# Altium schematic sheet USB-HUB-MUX.SchDoc
size A3; SheetNumber: 30; SheetTotal: 32
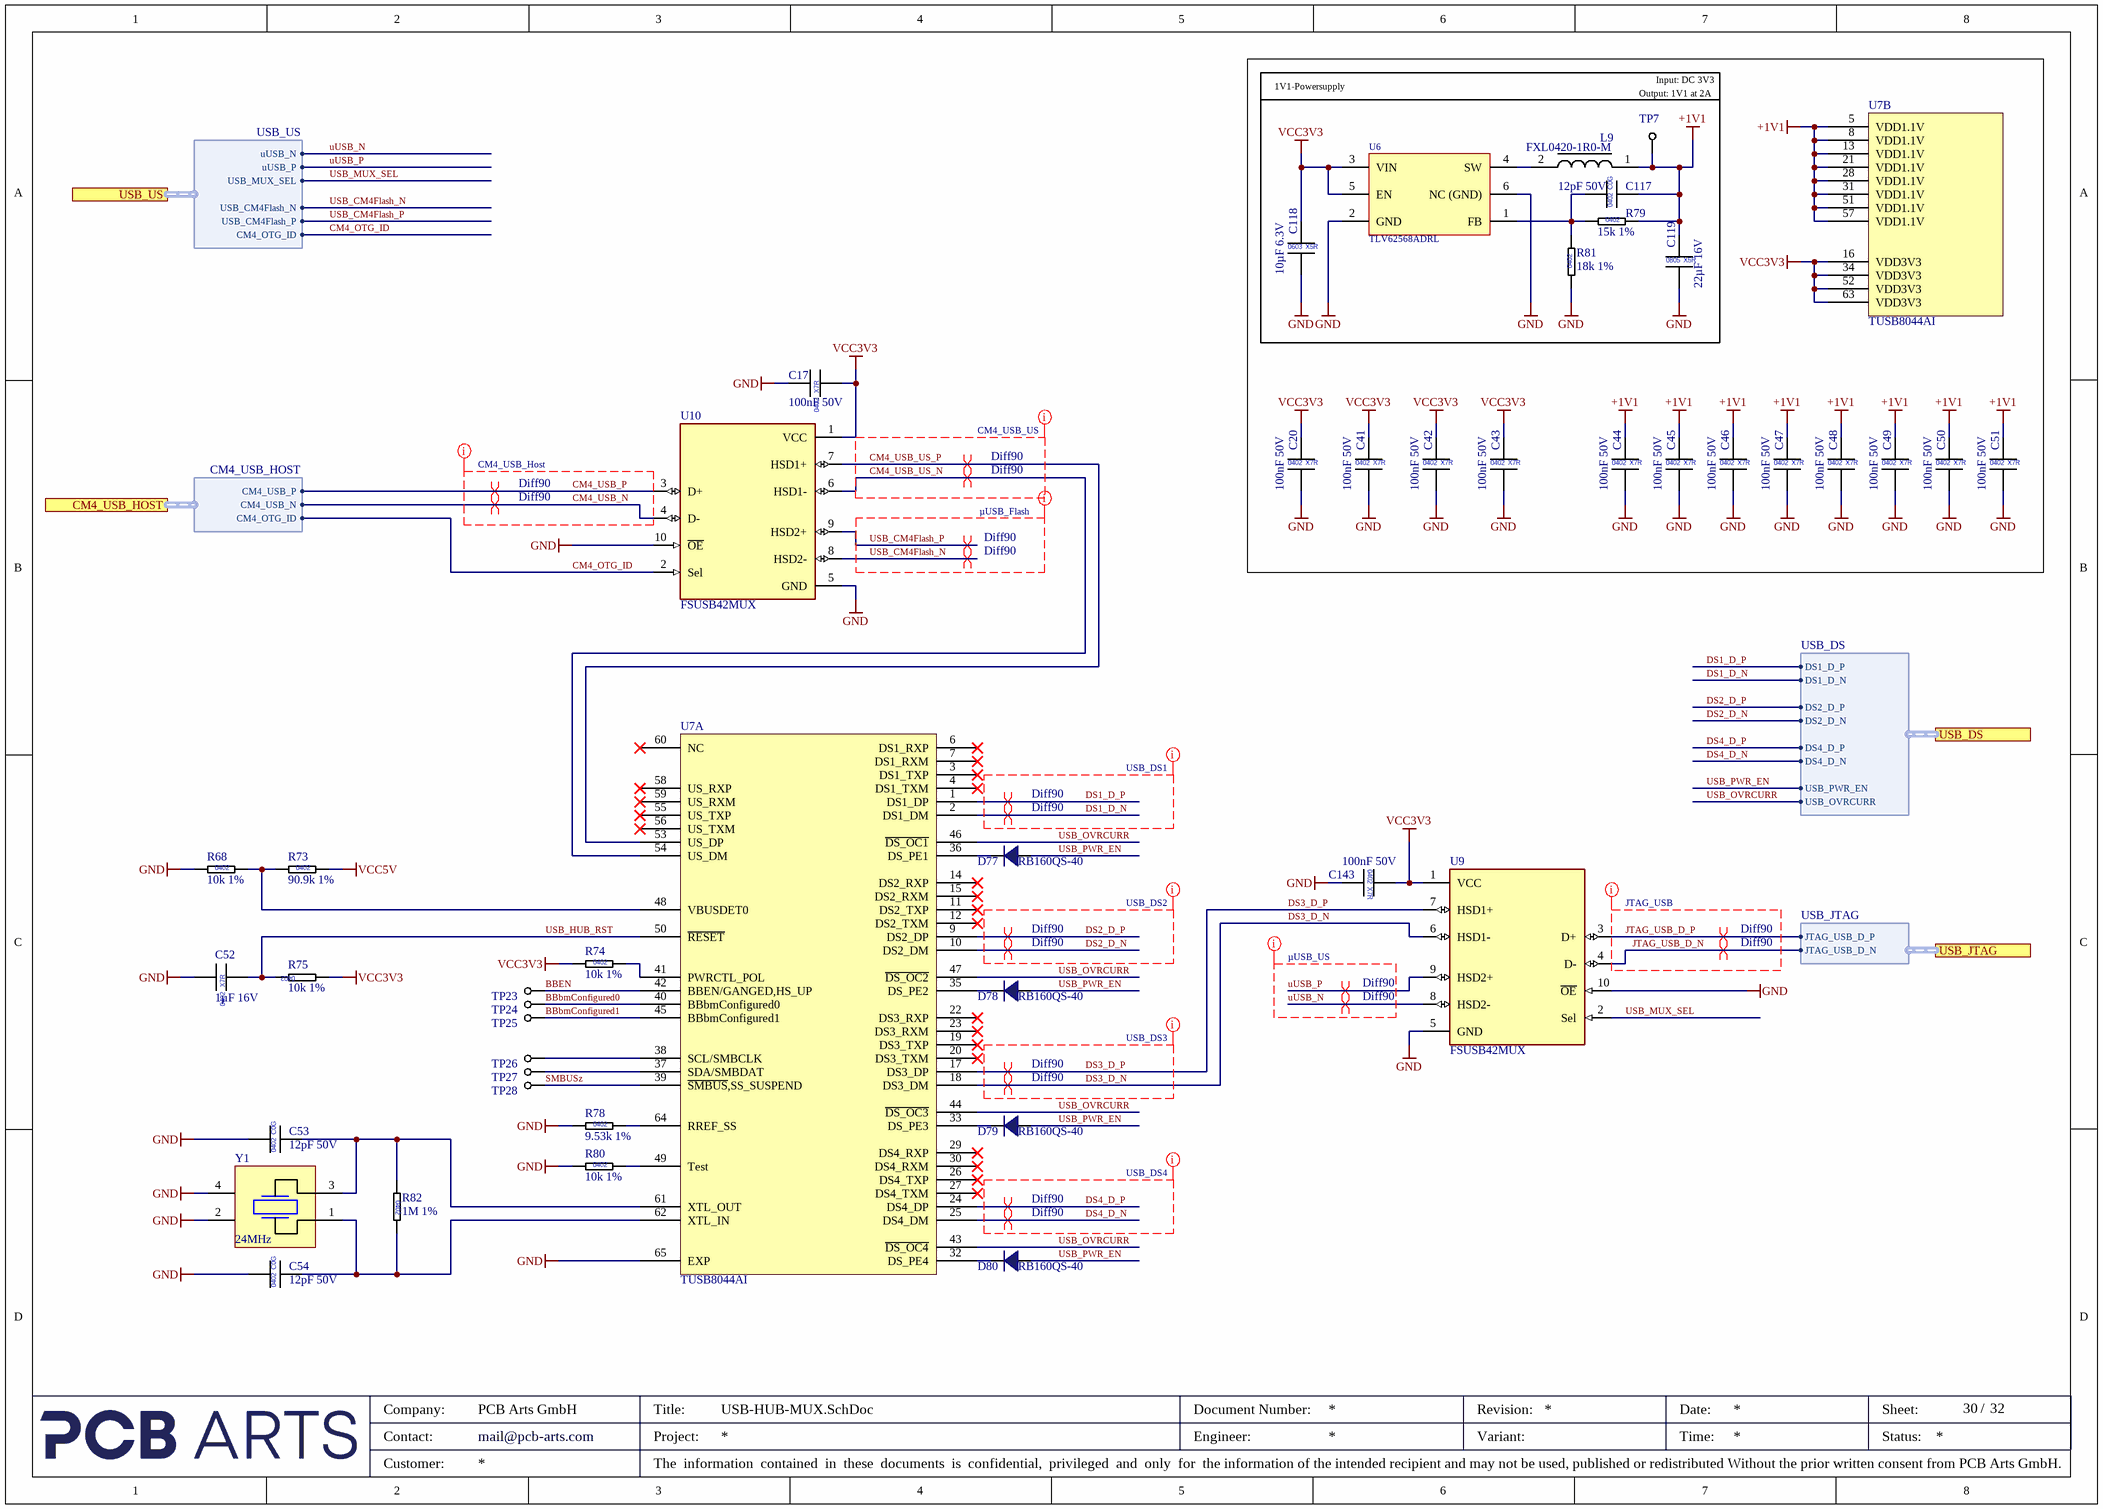
[diagram p0: USB-HUB-MUX.SchDoc]

## Parts
C17  100nF 50V  [CAP_0402_L]
C20  100nF 50V  [CAP_0402_L]
C41  100nF 50V  [CAP_0402_L]
C42  100nF 50V  [CAP_0402_L]
C43  100nF 50V  [CAP_0402_L]
C44  100nF 50V  [CAP_0402_L]
C45  100nF 50V  [CAP_0402_L]
C46  100nF 50V  [CAP_0402_L]
C47  100nF 50V  [CAP_0402_L]
C48  100nF 50V  [CAP_0402_L]
C49  100nF 50V  [CAP_0402_L]
C50  100nF 50V  [CAP_0402_L]
C51  100nF 50V  [CAP_0402_L]
C52  1µF 16V  [CAP_0402_L]
C53  12pF 50V  [CAP_0402_L]
C54  12pF 50V  [CAP_0402_L]
C117  12pF 50V  [CAP_0402_L]
C118  10µF 6.3V  [CAP_0603_L]
C119  22µF 16V  [CAP_0805]
C143  100nF 50V  [CAP_0402_L]
D77  RB160QS-40  [SOD-882]
D78  RB160QS-40  [SOD-882]
D79  RB160QS-40  [SOD-882]
D80  RB160QS-40  [SOD-882]
L9  FXL0420-1R0-M  [FXL0420-1R0-M]
R68  10k 1%  [RES_0402_L]
R73  90.9k 1%  [RES_0402_L]
R74  10k 1%  [RES_0402_L]
R75  10k 1%  [RES_0402_L]
R78  9.53k 1%  [RES_0402_L]
R79  15k 1%  [RES_0402_L]
R80  10k 1%  [RES_0402_L]
R81  18k 1%  [RES_0402_L]
R82  1M 1%  [RES_0402_L]
TP7  Testpoint  [Testpoint 0.8mm]  (value not drawn)  (no BOM)
TP23  Testpoint  [Testpoint 0.8mm]  (value not drawn)  (no BOM)
TP24  Testpoint  [Testpoint 0.8mm]  (value not drawn)  (no BOM)
TP25  Testpoint  [Testpoint 0.8mm]  (value not drawn)  (no BOM)
TP26  Testpoint  [Testpoint 0.8mm]  (value not drawn)  (no BOM)
TP27  Testpoint  [Testpoint 0.8mm]  (value not drawn)  (no BOM)
TP28  Testpoint  [Testpoint 0.8mm]  (value not drawn)  (no BOM)
U6  TLV62568ADRL  [SON50P150X80-6N]
U7  TUSB8044AI  [QFN50P900X900X90_HS-65N]  (parts A,B of 2)
U9  FSUSB42MUX  [SOP50P300X300X110-10N]
U10  FSUSB42MUX  [SOP50P300X300X110-10N]
Y1  Frequency: 24MHz  [ECX-2236B]  (hidden comment: ECS-240-10-36B2-CTN-TR)

## Ports
CM4_USB_HOST (harness CM4_USB_HOST, see Top-Level-Sheet[3B], Raspberry Pi CM4[8C]), USB_DS (harness USB_DS, see Top-Level-Sheet[3B], USB Connectors[8A]), USB_JTAG (harness USB_JTAG, see Top-Level-Sheet[3B], Bank 0_Bank 14[8A]), USB_US (harness USB_US, see Top-Level-Sheet[3B], USB Connectors[4B])

## Harnesses
CM4_USB_HOST: CM4_USB_P, CM4_USB_N, CM4_OTG_ID
USB_JTAG: JTAG_USB_D_P, JTAG_USB_D_N
USB_DS: DS1_D_P, DS1_D_N, DS2_D_P, DS2_D_N, DS4_D_P, DS4_D_N, USB_PWR_EN, USB_OVRCURR
USB_US: USB_MUX_SEL, uUSB_N, uUSB_P, CM4_OTG_ID, USB_CM4Flash_N, USB_CM4Flash_P

## Nets
+1V1: C44.1 C45.1 C46.1 C47.1 C48.1 C49.1 C50.1 C51.1 C117.2 C119.1 L9.1 R79.2 TP7.1(GND) U7.5(VDD1.1V) U7.8(VDD1.1V) U7.13(VDD1.1V) U7.21(VDD1.1V) U7.28(VDD1.1V) U7.31(VDD1.1V) U7.51(VDD1.1V) U7.57(VDD1.1V)
GND: C17.2 C20.2 C41.2 C42.2 C43.2 C44.2 C45.2 C46.2 C47.2 C48.2 C49.2 C50.2 C51.2 C52.2 C53.1 C54.1 C118.2 C119.2 C143.2 R68.1 R78.1 R80.1 R81.1 U6.2(GND) U6.6(NC_(GND)) U7.65(EXP) U9.5(GND) U9.10(~{OE}) U10.5(GND) U10.10(~{OE}) Y1.2 Y1.4
VCC3V3: C17.1 C20.1 C41.1 C42.1 C43.1 C118.1 C143.1 R74.1 R75.2 U6.3(VIN) U6.5(EN) U7.16(VDD3V3) U7.34(VDD3V3) U7.52(VDD3V3) U7.63(VDD3V3) U9.1(VCC) U10.1(VCC)
VCC5V: R73.2
BBbmConfigured0: TP24.1(GND) U7.40(BBbmConfigured0)
BBbmConfigured1: TP25.1(GND) U7.45(BBbmConfigured1)
BBEN: TP23.1(GND) U7.42(BBEN/GANGED,HS_UP)
CM4_OTG_ID: U10.2(Sel) ; port CM4_USB_HOST.CM4_OTG_ID, port USB_US.CM4_OTG_ID
CM4_USB_N: U10.4(D-) ; port CM4_USB_HOST.CM4_USB_N
CM4_USB_P: U10.3(D+) ; port CM4_USB_HOST.CM4_USB_P
CM4_USB_US_N: U7.54(US_DM) U10.6(HSD1-)
CM4_USB_US_P: U7.53(US_DP) U10.7(HSD1+)
DS1_D_N: U7.2(DS1_DM) ; port USB_DS.DS1_D_N
DS1_D_P: U7.1(DS1_DP) ; port USB_DS.DS1_D_P
DS2_D_N: U7.10(DS2_DM) ; port USB_DS.DS2_D_N
DS2_D_P: U7.9(DS2_DP) ; port USB_DS.DS2_D_P
DS3_D_N: U7.18(DS3_DM) U9.6(HSD1-)
DS3_D_P: U7.17(DS3_DP) U9.7(HSD1+)
DS4_D_N: U7.25(DS4_DM) ; port USB_DS.DS4_D_N
DS4_D_P: U7.24(DS4_DP) ; port USB_DS.DS4_D_P
JTAG_USB_D_N: U9.4(D-) ; port USB_JTAG.JTAG_USB_D_N
JTAG_USB_D_P: U9.3(D+) ; port USB_JTAG.JTAG_USB_D_P
SMBUSz: TP28.1(GND) U7.39(~{SMBUS},SS_SUSPEND)
USB_CM4Flash_N: U10.8(HSD2-) ; port USB_US.USB_CM4Flash_N
USB_CM4Flash_P: U10.9(HSD2+) ; port USB_US.USB_CM4Flash_P
USB_HUB_RST: C52.1 R75.1 U7.50(~{RESET})
USB_MUX_SEL: U9.2(Sel) ; port USB_US.USB_MUX_SEL
USB_OVRCURR: U7.43(~{DS_OC4}) U7.44(~{DS_OC3}) U7.46(~{DS_OC1}) U7.47(~{DS_OC2}) ; port USB_DS.USB_OVRCURR
USB_PWR_EN: D77.2 D78.2 D79.2 D80.2 ; port USB_DS.USB_PWR_EN
uUSB_N: U9.8(HSD2-) ; port USB_US.uUSB_N
uUSB_P: U9.9(HSD2+) ; port USB_US.uUSB_P
NetC53_2: C53.2 R82.1 U7.61(XTL_OUT) Y1.3
NetC54_2: C54.2 R82.2 U7.62(XTL_IN) Y1.1
NetC117_1: C117.1 R79.1 R81.2 U6.1(FB)
NetD77_1: D77.1 U7.36(DS_PE1)
NetD78_1: D78.1 U7.35(DS_PE2)
NetD79_1: D79.1 U7.33(DS_PE3)
NetD80_1: D80.1 U7.32(DS_PE4)
NetL9_2: L9.2 U6.4(SW)
NetR68_2: R68.2 R73.1 U7.48(VBUSDET0)
NetR74_2: R74.2 U7.41(PWRCTL_POL)
NetR78_2: R78.2 U7.64(RREF_SS)
NetR80_2: R80.2 U7.49(Test)
NetTP26_1: TP26.1(GND) U7.38(SCL/SMBCLK)
NetTP27_1: TP27.1(GND) U7.37(SDA/SMBDAT)

Not connected (* = marked no-connect by the designer): U7 3(DS1_TXP)* 4(DS1_TXM)* 6(DS1_RXP)* 7(DS1_RXM)* 11(DS2_TXP)* 12(DS2_TXM)* 14(DS2_RXP)* 15(DS2_RXM)* 19(DS3_TXP)* 20(DS3_TXM)* 22(DS3_RXP)* 23(DS3_RXM)* 26(DS4_TXP)* 27(DS4_TXM)* 29(DS4_RXP)* 30(DS4_RXM)* 55(US_TXP)* 56(US_TXM)* 58(US_RXP)* 59(US_RXM)* 60(NC)*

## Layout directives
net class USB_DS4: DS4_D_N, DS4_D_P
differential pair; net class Diff90: CM4_USB_N, CM4_USB_P, CM4_USB_US_N, CM4_USB_US_P, DS1_D_N, DS1_D_P, DS2_D_N, DS2_D_P, DS3_D_N, DS3_D_P, DS4_D_N, DS4_D_P, JTAG_USB_D_N, JTAG_USB_D_P, USB_CM4Flash_N, USB_CM4Flash_P, uUSB_N, uUSB_P
net class USB_DS3: DS3_D_N, DS3_D_P
net class USB_DS2: DS2_D_N, DS2_D_P
net class USB_DS1: DS1_D_N, DS1_D_P
net class µUSB_US: uUSB_N, uUSB_P
net class JTAG_USB: JTAG_USB_D_N, JTAG_USB_D_P
net class µUSB_Flash: USB_CM4Flash_N, USB_CM4Flash_P
net class CM4_USB_Host: CM4_USB_N, CM4_USB_P
net class CM4_USB_US: CM4_USB_US_N, CM4_USB_US_P

## Notes on the sheet
- 1V1-Powersupply
- (near TP7) Output: 1V1 at 2A
- Input: DC 3V3
- Company:
- Contact:
- Customer:
- mail@pcb-arts.com
- PCB Arts GmbH
- Title:
- Project:
- The  information  contained  in  these  documents  is  confidential,  privileged  and  only  for  the information of the intended recipient and may not be used, published or redistributed Without the prior written consent from PCB Arts GmbH.
- Engineer:
- Document Number:
- Revision:
- Variant:
- Date:
- Time:
- Sheet:
- Status:
- /
- (in symbol CAP_0402_1µF_16V) X7R; 0402
- (in symbol CAP_0402_12pF_50V) C0G; 0402
- (in symbol CAP_0402_100nF_50V) 0402; X7R
- (in symbol CAP_0603_10µF_6.3V) 0603; X5R
- (in symbol CAP_0805_22µF_16V) 0805; X5R
- (in symbol RES_0402_1M_1%) 0402
- (in symbol RES_0402_9.53k_1%) 0402
- (in symbol RES_0402_10k_1%) 0402
- (in symbol RES_0402_15k_1%) 0402
- (in symbol RES_0402_18k_1%) 0402
- (in symbol RES_0402_90.9k_1%) 0402

## Library data of the parts
C17 C20 C41-C51 C143 = CAP_0402_100nF_50V: Multilayer Ceramic Capacitors MLCC - SMD/SMT 0402 50VDC; Manufacturer 1: Murata Electronics; Manufacturer 1 Prt. Nr.: GCM155L8EH104KE07D; Manufacturer 2 Prt. Nr.: UMK105B7104KV-FR; Manufacturer 2: TDK
C52 = CAP_0402_1µF_16V: Multilayer Ceramic Capacitors MLCC - SMD/SMT 0402 16VDC; Manufacturer 1: Taiyo Yuden; Manufacturer 1 Prt. Nr.: EMK105BJ105MVHF; Manufacturer 2 Prt. Nr.: GRM155R61E105KA12D; Manufacturer 2: Murata Electronics
C53 C54 C117 = CAP_0402_12pF_50V: Multilayer Ceramic Capacitors MLCC - SMD/SMT 0402 50VDC; Manufacturer 1: Murata Electronics; Manufacturer 1 Prt. Nr.: GCM1555C1H120JA16J; Manufacturer 2 Prt. Nr.: C0402C120J5GACTU; Manufacturer 2: KEMET
C118 = CAP_0603_10µF_6.3V: Multilayer Ceramic Capacitors MLCC - SMD/SMT 0603 6.3VDC; Manufacturer 1: Murata Electronics; Manufacturer 1 Prt. Nr.: GRM188R60J106ME84J; Manufacturer 2 Prt. Nr.: JMK107ABJ106MA-T; Manufacturer 2: Taiyo Yuden
C119 = CAP_0805_22µF_16V: Multilayer Ceramic Capacitors MLCC - SMD/SMT 0805 16VDC; Manufacturer 1: Samsung Electro-Mechanics; Manufacturer 1 Prt. Nr.: CL21A226KOQNNNG; Manufacturer 2 Prt. Nr.: GRM21BC81C226ME44K; Manufacturer 2: Murata Electronics
D77-D80 = RB160QS-40_Schottky Dioden & Gleichrichter 40V: Schottky Dioden & Gleichrichter 40V SCHOTTKY DIODES & RECTIFIERS; Manufacturer 1: Rohm; Manufacturer 1 Prt. Nr.: RB160QS-40
L9 = 1uH 6A 27mΩ  FXL0420-1R0-M: 1uH ±20% 6A 27mΩ SMD,4.4x4.5x1.8mm Power Inductor; Manufacturer 1: cjiang(Changjiang Microelectronics Tech); Manufacturer 1 Prt. Nr.: FXL0420-1R0-M
R68 R74 R75 R80 = RES_0402_10k_1%: Thick Film Resistors - SMD 10kOhm 1%; Manufacturer 1: Vishay / Dale; Manufacturer 1 Prt. Nr.: CRCW040210K0FKEDC; Manufacturer 2 Prt. Nr.: RC0402FR-7W10KL; Manufacturer 2: Yageo
R73 = RES_0402_90.9k_1%: Thick Film Resistors - SMD 90.9k 1%; Manufacturer 1: Vishay / Dale; Manufacturer 1 Prt. Nr.: CRCW040290k9FKEDC; Manufacturer 2 Prt. Nr.: RC0402FR-7W90k9L; Manufacturer 2: Yageo
R78 = RES_0402_9.53k_1%: Thick Film Resistors - SMD 9.53kOhm 1%; Manufacturer 1: Panasonic; Manufacturer 1 Prt. Nr.: ERJ-2RKF9531X; Manufacturer 2 Prt. Nr.: RC0402FR-079K53L; Manufacturer 2: Yageo
R79 = RES_0402_15k_1%: Thick Film Resistors - SMD 15kOhm 1%; Manufacturer 1: Vishay / Dale; Manufacturer 1 Prt. Nr.: CRCW040215K0FKEDC; Manufacturer 2 Prt. Nr.: RC0402FR-1315KL; Manufacturer 2: Yageo
R81 = RES_0402_18k_1%: Thick Film Resistors - SMD 18kOhm 1%; Manufacturer 1: Vishay / Dale; Manufacturer 1 Prt. Nr.: CRCW040218K0FKEDC; Manufacturer 2 Prt. Nr.: RC0402FR-0718KL; Manufacturer 2: Yageo
R82 = RES_0402_1M_1%: Thick Film Resistors - SMD 1MOhm 1%; Manufacturer 1: Vishay / Dale; Manufacturer 1 Prt. Nr.: CRCW04021M00FKEDC; Manufacturer 2 Prt. Nr.: RC0402FR-071ML; Manufacturer 2: Yageo
TP7 TP23-TP28 = Testpoint 0.8mm
U6 = TLV62568ADRL_Step Down Converter 1A; 2A: Step Down Converter with Forced PWM in SOT563 Package; Manufacturer 1: Texas Instruments; Manufacturer 1 Prt. Nr.: TLV62568ADRL
U7 = TUSB8044AI_USB Hub IC, USB 3.2, 5Gbps, 4 Ports, industrial Temperature: USB Hub IC, USB 3.2, 5Gbps, 4 Ports, industrial Temperature; Manufacturer 1: Texas Instruments; Manufacturer 1 Prt. Nr.: TUSB8044AIRGCT
U9 U10 = FSUSB42MUX_IC USB SWITCH DPDT: IC USB SWITCH DPDT; Manufacturer 1: onsemi / Fairchild; Manufacturer 1 Prt. Nr.: FSUSB42MUX
Y1 = Quarz 24MHz ESR 50R10pF: 2.5 x 2.0 x 0.55 mm SMD Crystal; Manufacturer 1: ECS; Manufacturer 1 Prt. Nr.: ECS-240-10-36B2-CTN-TR